# Altium schematic sheet MCU_and_Acc.SchDoc: Microcontroller and Accelerometer
size A4; DrawnBy: Carles Bataller Sebastiá; Revision: A; SheetNumber: 3; SheetTotal: 3
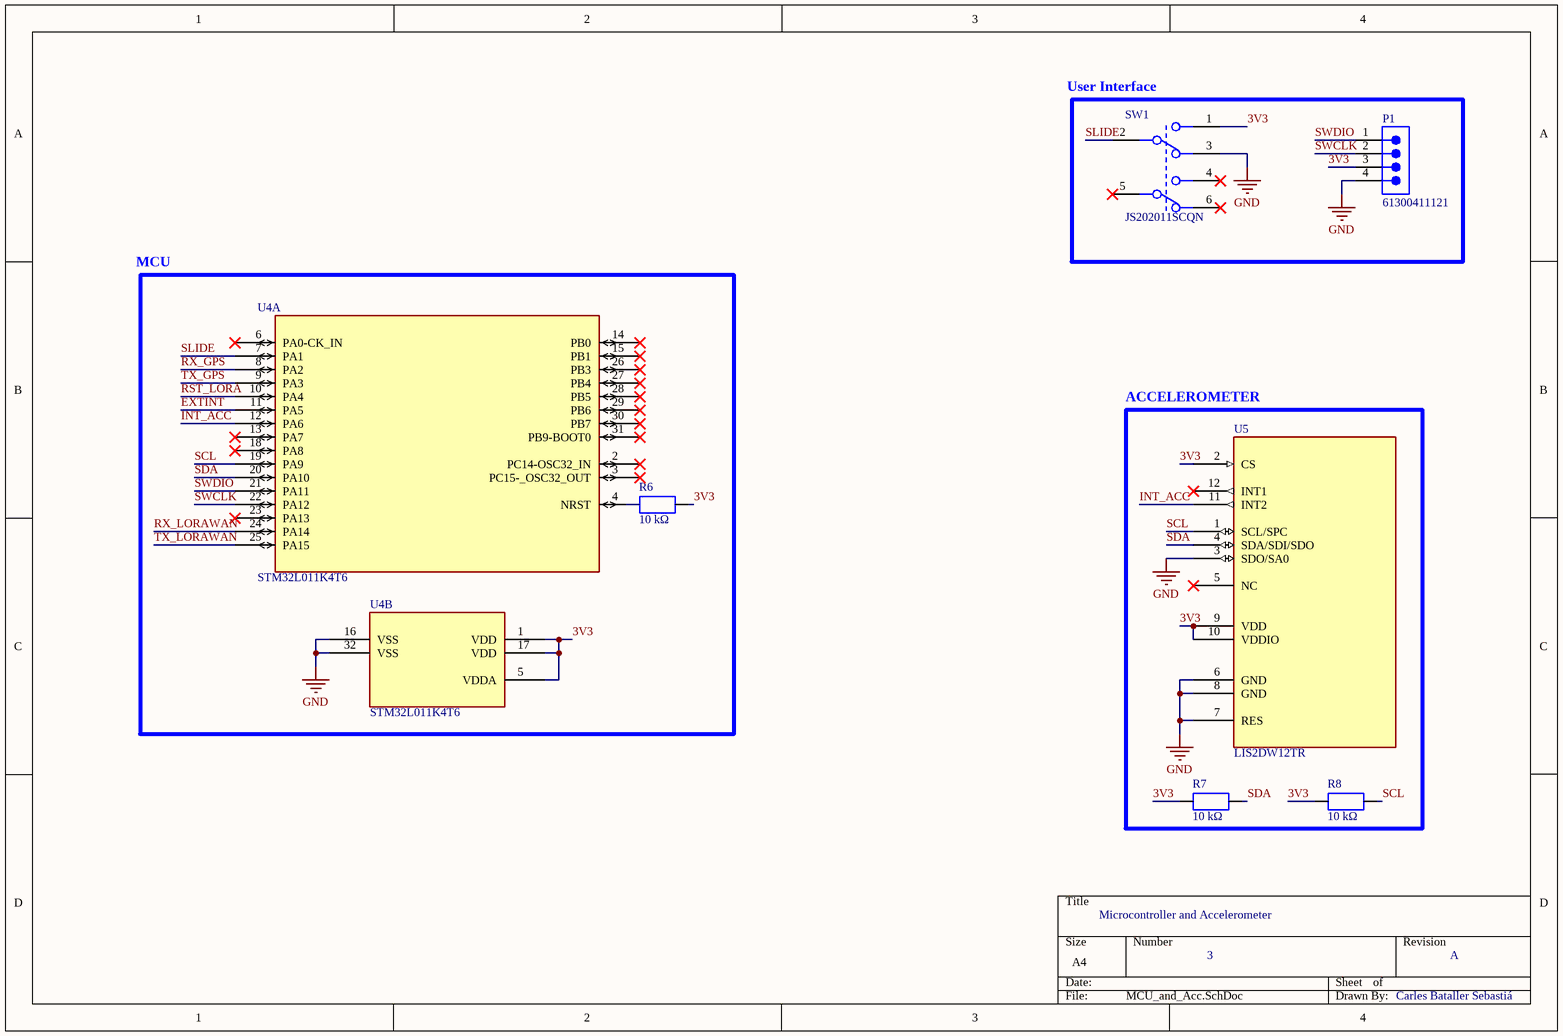
[diagram p0: MCU_and_Acc.SchDoc]

## Parts
P1  61300411121  [61300411121]
R6  10 kΩ  [RES_0201]
R7  10 kΩ  [RES_0201]
R8  10 kΩ  [RES_0201]
SW1  JS202011SCQN  [FP-JS202011SCQN-MFG]
U4  STM32L011K4T6  [LQFP32_7X7X1P4]  (parts A,B of 2)
U5  LIS2DW12TR  [LGA-12_2X2X0P7_STM]

## Blocks framed on the sheet
User Interface: P1 SW1
MCU: R6 U4
ACCELEROMETER: R7 R8 U5

## Nets
GND: P1.4 SW1.3 U4.16(VSS) U4.32(VSS) U5.3(SDO/SA0) U5.6(GND) U5.7(RES) U5.8(GND)
3V3: P1.3 R6.1 R7.2 R8.2 SW1.1 U4.1(VDD) U4.5(VDDA) U4.17(VDD) U5.2(CS) U5.9(VDD) U5.10(VDDIO)
EXTINT: U4.11(PA5)
INT_ACC: U4.12(PA6) U5.11(INT2)
RST_LORA: U4.10(PA4)
RX_GPS: U4.8(PA2)
RX_LORAWAN: U4.24(PA14)
SCL: R8.1 U4.19(PA9) U5.1(SCL/SPC)
SDA: R7.1 U4.20(PA10) U5.4(SDA/SDI/SDO)
SLIDE: SW1.2 U4.7(PA1)
SWCLK: P1.2 U4.22(PA12)
SWDIO: P1.1 U4.21(PA11)
TX_GPS: U4.9(PA3)
TX_LORAWAN: U4.25(PA15)
NetR6_2: R6.2 U4.4(NRST)

Not connected (* = marked no-connect by the designer): SW1 4* 5* 6*; U4 2(PC14-OSC32_IN)* 3(PC15-_OSC32_OUT)* 6(PA0-CK_IN)* 13(PA7)* 14(PB0)* 15(PB1)* 18(PA8)* 23(PA13)* 26(PB3)* 27(PB4)* 28(PB5)* 29(PB6)* 30(PB7)* 31(PB9-BOOT0)*; U5 5(NC)* 12(INT1)*

## Library data of the parts
P1 = CMP-1502-01064-4: THT Vertical Pin Header WR-PHD, Pitch 2.54 mm, Single Row, 4 pins; Manufacturer 1: Würth Elektronik; Connector Type: Male Pin; Gender: Male; Current Rating: 3A; Number of Positions: 4; Operating Supply Voltage: 250V; Contact Resistance: 20mΩ; Pitch: 2.54mm; Max Operating Temperature: 105°C; Mount: Through Hole; Contact Material: Gold; Contact Plating: Gold; Number of Contacts: 4; Orientation: Vertical; Packaging: Bulk; Contact Mating Length: 5.9944mm; Voltage Rating: 250V; Number of Rows: 1; Height: 8.89mm; Lead Free: Lead Free; Lead Pitch: 2.54mm; Number of Pins: 4; Color: Black; Min Operating Temperature: -40°C; RoHS: Compliant; Termination: Solder; Supplier 1: Mouser; Supplier Part Number 1: 710-61300411121; Manufacturer Part Number 1: 61300411121
R6-R8 = RES_0201: Thick Film Resistors - SMD 0201 10K0 1% Lead Free; Tolerance: 0.1%; Resistance: 200 Ohm; Supplier 1: Mouser; Supplier Part Number 1: 791-WR02X1002FAR; LCSC Part Number: C852221
SW1 = CMP-2000-05087-3: SWITCH SLIDE DPDT 300MA 6V; Manufacturer 1: C&K; Switch Function: On-On; Actuator Type: Standard; Switch Travel: 2mm; Actuator Color: Black; Contact Resistance: 70mR; Electrical Life: 5000Cycles; Actuator Material: Nylon; REACH SVHC: No SVHC; Series: JS; Min Operating Temperature: -20°C; Depth: 7.5mm; Housing Material: Nylon; Voltage Rating (DC): 6V; Max Operating Temperature: 85°C; Contact Current Rating: 300mA; Package Quantity: 1; Contact Plating: Silver; Contact Material: Copper Alloy; Throw Configuration: DPDT; Current Rating: 300mA; Orientation: Vertical; Max Current Rating: 300mA; Max Voltage Rating (DC): 6V; Flammability Rating: UL94 V-2; Length: 9mm; Packaging: Tape and Reel; Mount: Surface Mount; Actuator Length: 2mm; Lead Free: Lead Free; Termination: Gull Wing; Radiation Hardening: No; Supplier 1: Mouser; Supplier Part Number 1: 611-JS202011SCQN; Manufacturer Part Number 1: JS202011SCQN; Supplier Unit Price 1: 0,8; Supplier Subtotal 1: 0,8
U4 = STM32L011K4T6: Ultra-low-power Arm Cortex-M0+ MCU with 16-Kbytes of Flash memory, 32 MHz CPU; Manufacturer 1: STMicroelectronics; Copyright: Copyright (C) 2026 Ultra Librarian. All rights reserved.; Manufacturer Part Number 1: STM32L011K4T6; Datasheet: https://www.st.com/resource/en/datasheet/stm32l011d4.pdf; RefDes: RefDes; Type: Type; Supplier 1: Mouser; Supplier Part Number 1: 511-STM32L011K4T6
U5 = LIS2DW12TR: MEMS digital output motion sensor: high-performance ultralow-power 3-axis &#34;femto&#34; accelerometer; Manufacturer_Name: STMicroelectronics; Copyright: Copyright (C) 2026 Ultra Librarian. All rights reserved.; RefDes: RefDes; Type: Type; Manufacturer_Part_Number: LIS2DW12TR